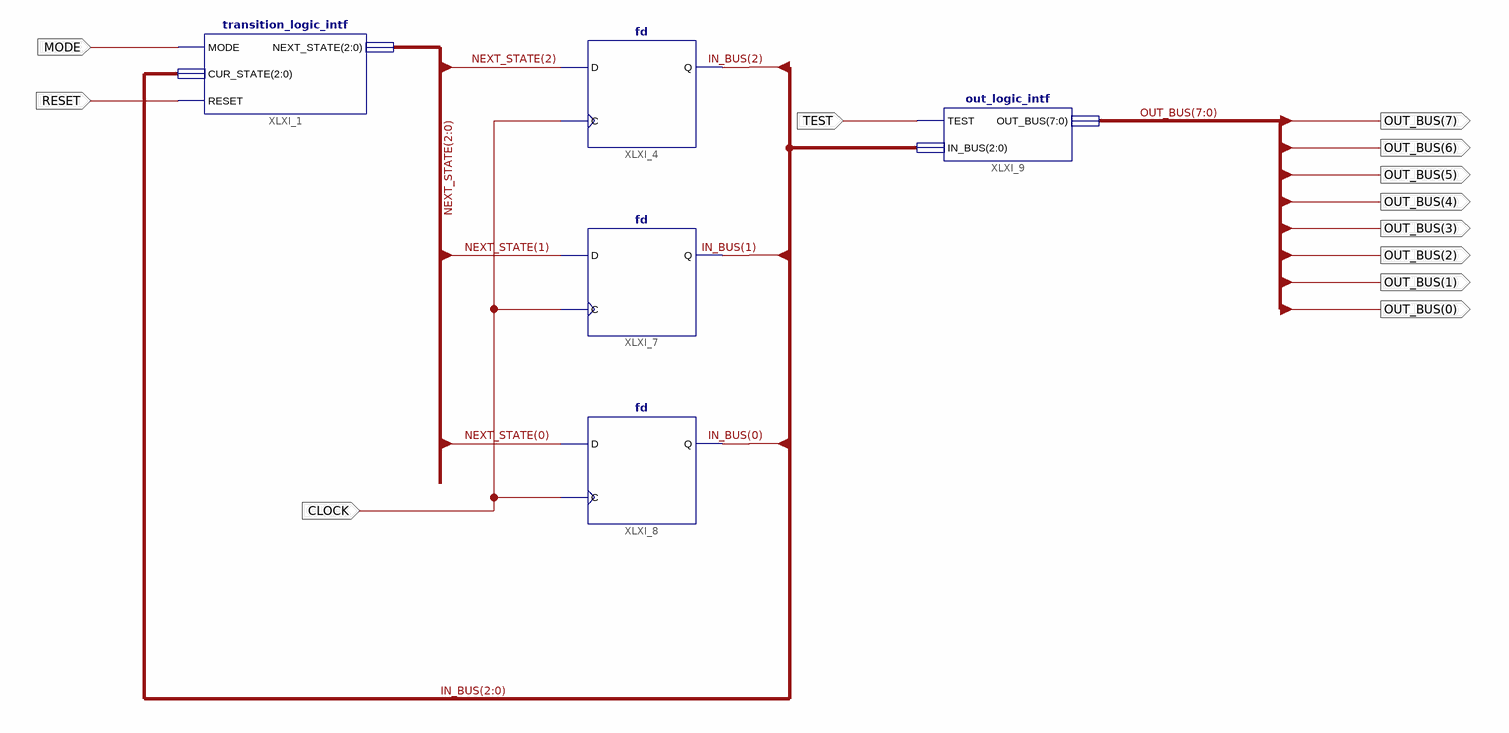
[diagram p0: schematic sheet 1]
// Xilinx ISE schematic LigthController.sch (spartan3a) as structural Verilog: 5 symbols, 12 ports
module LigthController (
  input  MODE,
  input  RESET,
  input  CLOCK,
  input  TEST,
  output [7:0] OUT_BUS
);

  wire [2:0] IN_BUS, NEXT_STATE;

  transition_logic_intf XLXI_1 (.MODE(MODE), .RESET(RESET), .CUR_STATE(IN_BUS), .NEXT_STATE(NEXT_STATE));
  fd #(.INIT("0")) XLXI_8 (.C(CLOCK), .D(NEXT_STATE[0]), .Q(IN_BUS[0]));
  fd #(.INIT("0")) XLXI_7 (.C(CLOCK), .D(NEXT_STATE[1]), .Q(IN_BUS[1]));
  fd #(.INIT("0")) XLXI_4 (.C(CLOCK), .D(NEXT_STATE[2]), .Q(IN_BUS[2]));
  out_logic_intf XLXI_9 (.TEST(TEST), .IN_BUS(IN_BUS), .OUT_BUS(OUT_BUS));
endmodule
